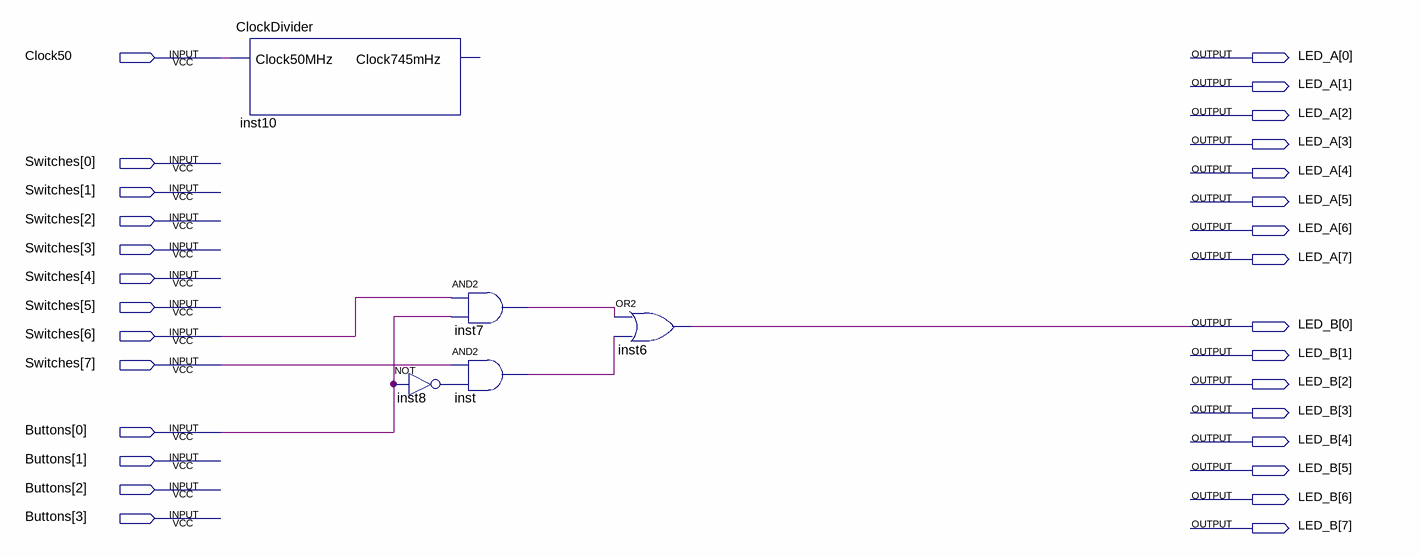
[diagram p0: schematic sheet]
// Quartus schematic 1BitMultiplexer.bdf as structural Verilog: 5 symbols, 29 pins
module \1BitMultiplexer  (
  input  Clock50,
  input  [7:0] Switches,
  input  [3:0] Buttons,
  output [7:0] LED_A,
  output [7:0] LED_B
);

  wire inst7_out, inst8_out, inst_out;

  ClockDivider inst10 (.Clock50MHz(Clock50));  // open: Clock745mHz
  not inst8 (inst8_out, Buttons[0]);
  and inst7 (inst7_out, Switches[6], Buttons[0]);
  and inst (inst_out, Switches[7], inst8_out);
  or inst6 (LED_B[0], inst7_out, inst_out);
endmodule
